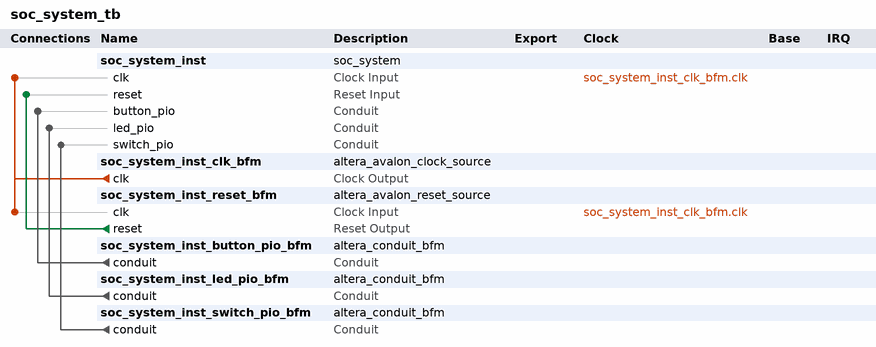
[diagram p0: system contents]
# Platform Designer (Qsys) system soc_system_tb, Cyclone V 5CSEMA5F31C6
# Parameters at their usual value, and those the tool derives, are not listed.
package require -exact qsys 18.1
create_system soc_system_tb
set_project_property DEVICE_FAMILY {Cyclone V}
set_project_property DEVICE 5CSEMA5F31C6

add_instance soc_system_inst soc_system 1.0

add_instance soc_system_inst_clk_bfm altera_avalon_clock_source 18.1

add_instance soc_system_inst_reset_bfm altera_avalon_reset_source 18.1
set_instance_parameter_value soc_system_inst_reset_bfm ASSERT_HIGH_RESET 0
set_instance_parameter_value soc_system_inst_reset_bfm INITIAL_RESET_CYCLES 50

add_instance soc_system_inst_button_pio_bfm altera_conduit_bfm 18.1
set_instance_parameter_value soc_system_inst_button_pio_bfm CLOCKED_SIGNAL false
set_instance_parameter_value soc_system_inst_button_pio_bfm ENABLE_RESET false
set_instance_parameter_value soc_system_inst_button_pio_bfm SIGNAL_DIRECTIONS output
set_instance_parameter_value soc_system_inst_button_pio_bfm SIGNAL_WIDTHS 4

add_instance soc_system_inst_led_pio_bfm altera_conduit_bfm 18.1
set_instance_parameter_value soc_system_inst_led_pio_bfm CLOCKED_SIGNAL false
set_instance_parameter_value soc_system_inst_led_pio_bfm ENABLE_RESET false
set_instance_parameter_value soc_system_inst_led_pio_bfm SIGNAL_DIRECTIONS input
set_instance_parameter_value soc_system_inst_led_pio_bfm SIGNAL_WIDTHS 4

add_instance soc_system_inst_switch_pio_bfm altera_conduit_bfm 18.1
set_instance_parameter_value soc_system_inst_switch_pio_bfm CLOCKED_SIGNAL false
set_instance_parameter_value soc_system_inst_switch_pio_bfm ENABLE_RESET false
set_instance_parameter_value soc_system_inst_switch_pio_bfm SIGNAL_DIRECTIONS output
set_instance_parameter_value soc_system_inst_switch_pio_bfm SIGNAL_WIDTHS 3

# connections
add_connection soc_system_inst_clk_bfm.clk soc_system_inst.clk clock
add_connection soc_system_inst_clk_bfm.clk soc_system_inst_reset_bfm.clk clock
add_connection soc_system_inst_reset_bfm.reset soc_system_inst.reset reset
add_connection soc_system_inst_button_pio_bfm.conduit soc_system_inst.button_pio conduit
add_connection soc_system_inst_led_pio_bfm.conduit soc_system_inst.led_pio conduit
add_connection soc_system_inst_switch_pio_bfm.conduit soc_system_inst.switch_pio conduit

set_interconnect_requirement {$system} qsys_mm.clockCrossingAdapter HANDSHAKE
set_interconnect_requirement {$system} qsys_mm.enableEccProtection FALSE
set_interconnect_requirement {$system} qsys_mm.insertDefaultSlave FALSE
set_interconnect_requirement {$system} qsys_mm.maxAdditionalLatency 1

save_system soc_system_tb.qsys
